# Altium schematic sheet Schematic.SchDoc
size A4; Revision: 1.0; SheetNumber: 1; SheetTotal: 1; TYPE_DOC: SCHEMATIC; PROJECT_BY: JOÃO VITOR RAMOS MITIDIERO; DATE_ISSUE: 05/11/2025; NAME_ENGLISH: ANALOG DIMMER; NAME_PORT: DIMMER ANALÓGICO; GITHUB_LINK: https://github.com/jvhardev303/AnalogDimmer
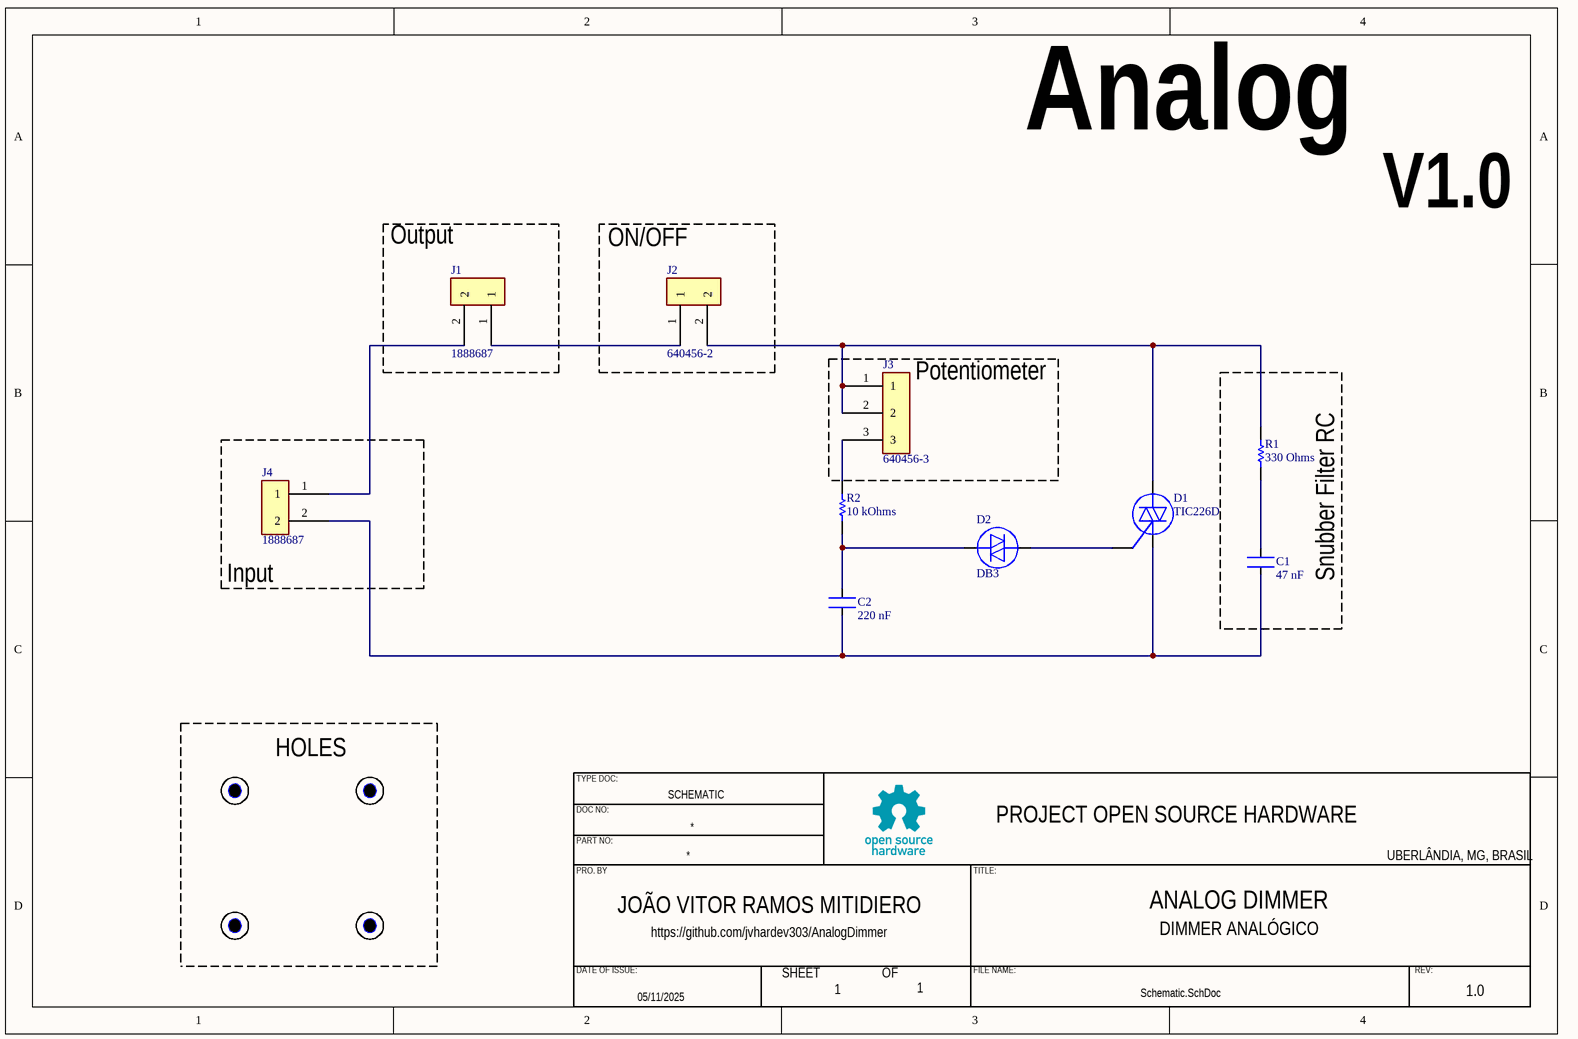
[diagram p0: Schematic.SchDoc]

## Parts
C1  value 47 nF  [CERAMIC_CAPACITOR_GENERIC_PTH]  (hidden comment: CAPACITOR_N_POL_47nF)
C2  value 220 nF  [CERAMIC_CAPACITOR_GENERIC_PTH]  (hidden comment: CAPACITOR_N_POL_220nF)
D1  PartNumber: TIC226D  [TO-220]  (hidden comment: TRIAC_TIC226D)
D2  PartNumber: DB3  [DO-35]  (hidden comment: DIAC_DB3)
HOLE1  FURO_M3  [FURO_M3]  (value not drawn)
HOLE2  FURO_M3  [FURO_M3]  (value not drawn)
HOLE3  FURO_M3  [FURO_M3]  (value not drawn)
HOLE4  FURO_M3  [FURO_M3]  (value not drawn)
J1  BORNE_2P_1888687  [1888687]  (value not drawn)
J2  CONECTOR_2P_640456-2  [640456-2]  (value not drawn)
J3  CONECTOR_3P_640456-3  [640456-3]  (value not drawn)
J4  BORNE_2P_1888687  [1888687]  (value not drawn)
R1  value 330 Ohms  [RESISTOR_1-4_PTH]  (hidden comment: RESISTOR_330OHMS)
R2  value 10 kOhms  [RESISTOR_1-4_PTH]  (hidden comment: RESISTOR_10KOHMS)

## Blocks framed on the sheet
Output: J1
ON/OFF: J2
Potentiometer: J3
Input: J4
HOLES: HOLE1-HOLE4

## Nets
NetC1_1: C1.1 R1.1
NetC1_2: C1.2 C2.2 D1.1 J4.2
NetC2_1: C2.1 D2.1 R2.1
NetD1_2: D1.2 J2.2 J3.1 J3.2 R1.2
NetD1_3: D1.3 D2.2
NetJ1_1: J1.1 J2.1
NetJ1_2: J1.2 J4.1
NetJ3_3: J3.3 R2.2

## Notes on the sheet
- Analog Dimmer
- V1.0
- Snubber Filter RC
- TYPE DOC:
- DOC NO:
- PART NO:
- PROJECT OPEN SOURCE HARDWARE
- UBERLÂNDIA, MG, BRASIL
- PRO. BY
- TITLE:
- DATE OF ISSUE:
- SHEET
- OF
- FILE NAME:
- REV:

## Library data of the parts
J1 J4 = BORNE_2P_1888687: PartNumber: 1888687
J2 = CONECTOR_2P_640456-2: PartNumber: 640456-2
J3 = CONECTOR_3P_640456-3: PartNumber: 640456-3